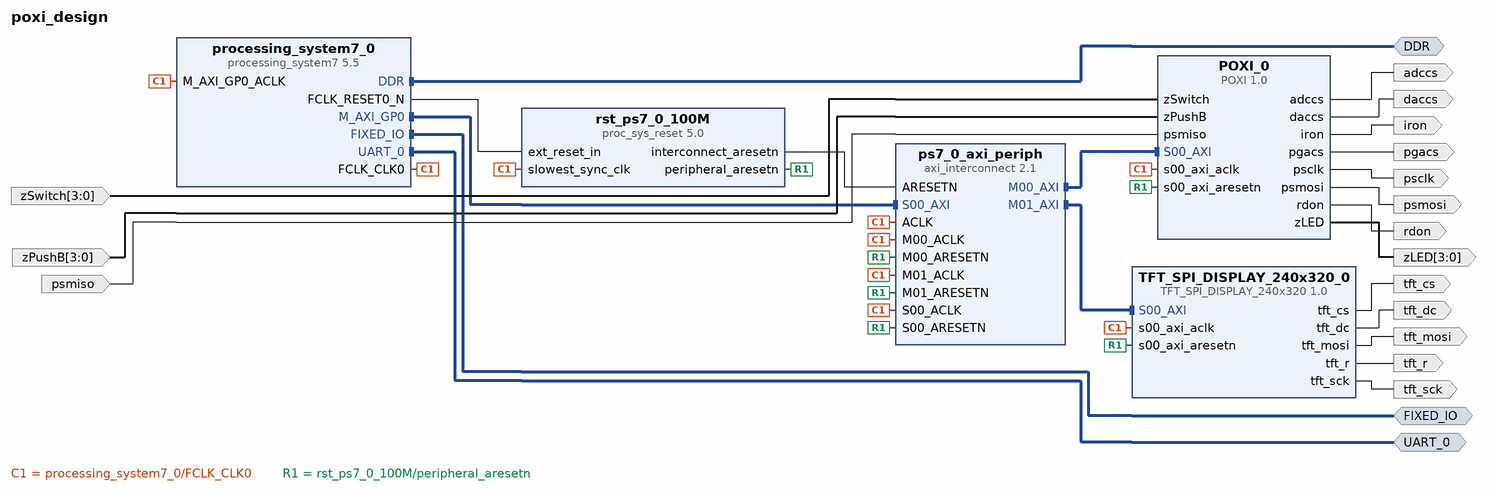
[diagram p0: block diagram of the top level]
# Vivado block design poxi_design, xc7z010clg400-1, Vivado 2016.3
create_bd_design poxi_design

create_bd_intf_port -mode Master -vlnv xilinx.com:interface:ddrx_rtl:1.0 DDR
create_bd_intf_port -mode Master -vlnv xilinx.com:display_processing_system7:fixedio_rtl:1.0 FIXED_IO
create_bd_intf_port -mode Master -vlnv xilinx.com:interface:uart_rtl:1.0 UART_0
create_bd_port -dir I -from 3 -to 0 zSwitch
create_bd_port -dir I -from 3 -to 0 zPushB
create_bd_port -dir I psmiso
create_bd_port -dir O -from 3 -to 0 zLED
create_bd_port -dir O psclk
create_bd_port -dir O adccs
create_bd_port -dir O rdon
create_bd_port -dir O iron
create_bd_port -dir O daccs
create_bd_port -dir O pgacs
create_bd_port -dir O psmosi
create_bd_port -dir O tft_dc
create_bd_port -dir O tft_r
create_bd_port -dir O tft_mosi
create_bd_port -dir O tft_sck
create_bd_port -dir O tft_cs

create_bd_cell -type ip -vlnv xilinx.com:ip:processing_system7:5.5 processing_system7_0
set_property -dict [list \
  CONFIG.PCW_UIPARAM_DDR_FREQ_MHZ 525 \
  CONFIG.PCW_CRYSTAL_PERIPHERAL_FREQMHZ 50.000000 \
  CONFIG.PCW_APU_PERIPHERAL_FREQMHZ 650 \
  CONFIG.PCW_SDIO_PERIPHERAL_FREQMHZ 50 \
  CONFIG.PCW_FPGA0_PERIPHERAL_FREQMHZ 100 \
  CONFIG.PCW_PRESET_BANK1_VOLTAGE {LVCMOS 1.8V} \
  CONFIG.PCW_UIPARAM_DDR_PARTNO {MT41K128M16 JT-125} \
  CONFIG.PCW_QSPI_PERIPHERAL_ENABLE 1 \
  CONFIG.PCW_QSPI_GRP_SINGLE_SS_ENABLE 1 \
  CONFIG.PCW_QSPI_GRP_FBCLK_ENABLE 1 \
  CONFIG.PCW_ENET0_PERIPHERAL_ENABLE 0 \
  CONFIG.PCW_SD0_PERIPHERAL_ENABLE 1 \
  CONFIG.PCW_SD0_GRP_CD_ENABLE 1 \
  CONFIG.PCW_SD0_GRP_CD_IO {MIO 47} \
  CONFIG.PCW_SD0_GRP_WP_ENABLE 1 \
  CONFIG.PCW_UART0_PERIPHERAL_ENABLE 1 \
  CONFIG.PCW_UART0_UART0_IO EMIO \
  CONFIG.PCW_UART1_PERIPHERAL_ENABLE 1 \
  CONFIG.PCW_USB0_PERIPHERAL_ENABLE 0 \
  CONFIG.PCW_GPIO_MIO_GPIO_ENABLE 0 \
] [get_bd_cells processing_system7_0]
# 39 more settings of processing_system7_0 are not shown: defaults, MIO pin electricals, DDR timing, and values the tool derives
create_bd_cell -type ip -vlnv Yarib:user:POXI:1.0 POXI_0
create_bd_cell -type ip -vlnv xilinx.com:ip:axi_interconnect:2.1 ps7_0_axi_periph
set_property -dict {CONFIG.NUM_MI 2} [get_bd_cells ps7_0_axi_periph]
create_bd_cell -type ip -vlnv xilinx.com:ip:proc_sys_reset:5.0 rst_ps7_0_100M
create_bd_cell -type ip -vlnv Yarib:user:TFT_SPI_DISPLAY_240x320:1.0 TFT_SPI_DISPLAY_240x320_0

# ---- connections ----

connect_bd_intf_net [get_bd_intf_pins processing_system7_0/M_AXI_GP0] [get_bd_intf_pins ps7_0_axi_periph/S00_AXI]
connect_bd_intf_net [get_bd_intf_pins ps7_0_axi_periph/M00_AXI] [get_bd_intf_pins POXI_0/S00_AXI]
connect_bd_intf_net [get_bd_intf_pins ps7_0_axi_periph/M01_AXI] [get_bd_intf_pins TFT_SPI_DISPLAY_240x320_0/S00_AXI]
connect_bd_intf_net [get_bd_intf_ports DDR] [get_bd_intf_pins processing_system7_0/DDR]
connect_bd_intf_net [get_bd_intf_ports FIXED_IO] [get_bd_intf_pins processing_system7_0/FIXED_IO]
connect_bd_intf_net [get_bd_intf_ports UART_0] [get_bd_intf_pins processing_system7_0/UART_0]
connect_bd_net [get_bd_pins processing_system7_0/FCLK_CLK0] \
  [get_bd_pins processing_system7_0/M_AXI_GP0_ACLK] [get_bd_pins ps7_0_axi_periph/S00_ACLK] \
  [get_bd_pins rst_ps7_0_100M/slowest_sync_clk] [get_bd_pins ps7_0_axi_periph/ACLK] [get_bd_pins POXI_0/s00_axi_aclk] \
  [get_bd_pins ps7_0_axi_periph/M00_ACLK] [get_bd_pins TFT_SPI_DISPLAY_240x320_0/s00_axi_aclk] \
  [get_bd_pins ps7_0_axi_periph/M01_ACLK]
connect_bd_net [get_bd_pins processing_system7_0/FCLK_RESET0_N] [get_bd_pins rst_ps7_0_100M/ext_reset_in]
connect_bd_net [get_bd_pins rst_ps7_0_100M/peripheral_aresetn] \
  [get_bd_pins ps7_0_axi_periph/S00_ARESETN] [get_bd_pins POXI_0/s00_axi_aresetn] [get_bd_pins ps7_0_axi_periph/M00_ARESETN] \
  [get_bd_pins TFT_SPI_DISPLAY_240x320_0/s00_axi_aresetn] [get_bd_pins ps7_0_axi_periph/M01_ARESETN]
connect_bd_net [get_bd_pins rst_ps7_0_100M/interconnect_aresetn] [get_bd_pins ps7_0_axi_periph/ARESETN]
connect_bd_net [get_bd_ports zSwitch] [get_bd_pins POXI_0/zSwitch]
connect_bd_net [get_bd_ports zPushB] [get_bd_pins POXI_0/zPushB]
connect_bd_net [get_bd_ports psmiso] [get_bd_pins POXI_0/psmiso]
connect_bd_net [get_bd_pins POXI_0/zLED] [get_bd_ports zLED]
connect_bd_net [get_bd_pins POXI_0/psclk] [get_bd_ports psclk]
connect_bd_net [get_bd_pins POXI_0/adccs] [get_bd_ports adccs]
connect_bd_net [get_bd_pins POXI_0/rdon] [get_bd_ports rdon]
connect_bd_net [get_bd_pins POXI_0/iron] [get_bd_ports iron]
connect_bd_net [get_bd_pins POXI_0/daccs] [get_bd_ports daccs]
connect_bd_net [get_bd_pins POXI_0/pgacs] [get_bd_ports pgacs]
connect_bd_net [get_bd_pins POXI_0/psmosi] [get_bd_ports psmosi]
connect_bd_net [get_bd_pins TFT_SPI_DISPLAY_240x320_0/tft_dc] [get_bd_ports tft_dc]
connect_bd_net [get_bd_pins TFT_SPI_DISPLAY_240x320_0/tft_r] [get_bd_ports tft_r]
connect_bd_net [get_bd_pins TFT_SPI_DISPLAY_240x320_0/tft_mosi] [get_bd_ports tft_mosi]
connect_bd_net [get_bd_pins TFT_SPI_DISPLAY_240x320_0/tft_sck] [get_bd_ports tft_sck]
connect_bd_net [get_bd_pins TFT_SPI_DISPLAY_240x320_0/tft_cs] [get_bd_ports tft_cs]

# ---- address map ----
assign_bd_address -offset 0x43C00000 -range 64K -target_address_space [get_bd_addr_spaces processing_system7_0/Data] [get_bd_addr_segs POXI_0/S00_AXI/S00_AXI_reg]
assign_bd_address -offset 0x43C10000 -range 64K -target_address_space [get_bd_addr_spaces processing_system7_0/Data] [get_bd_addr_segs TFT_SPI_DISPLAY_240x320_0/S00_AXI/S00_AXI_reg]

validate_bd_design
save_bd_design
